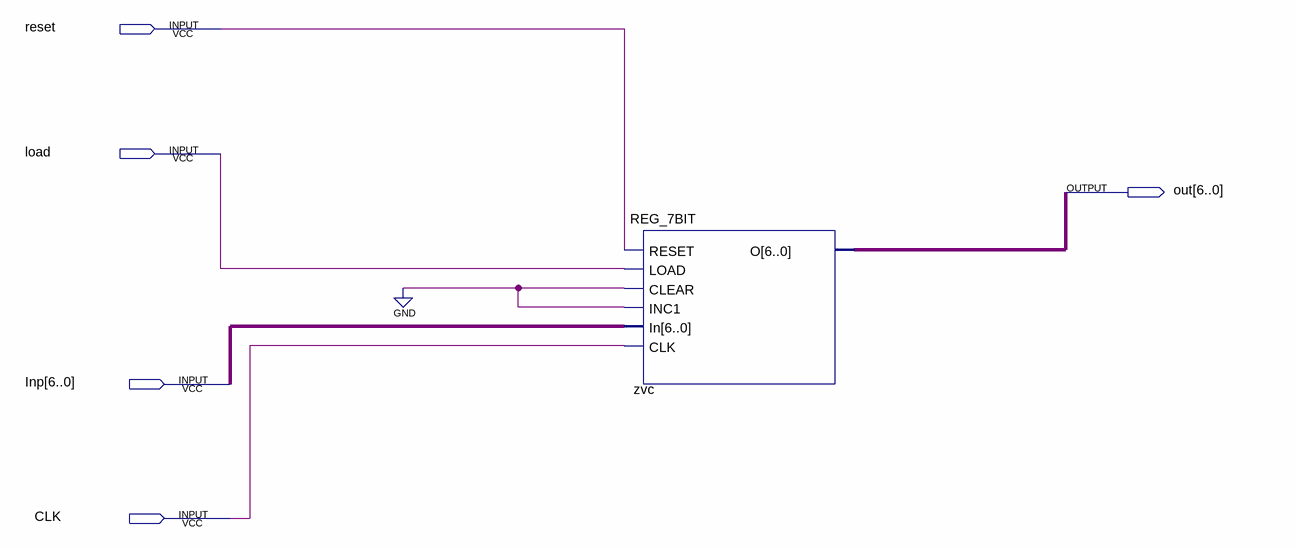
[diagram p0: schematic sheet]
// Quartus schematic CAD.bdf as structural Verilog: 1 symbols, 5 pins
module CAD (
  input  reset,
  input  load,
  input  [6:0] Inp,
  input  CLK,
  output [6:0] out
);

  REG_7BIT zvc (.RESET(reset), .LOAD(load), .CLEAR(1'b0), .INC1(1'b0), .In(Inp), .CLK(CLK), .O(out));
endmodule
